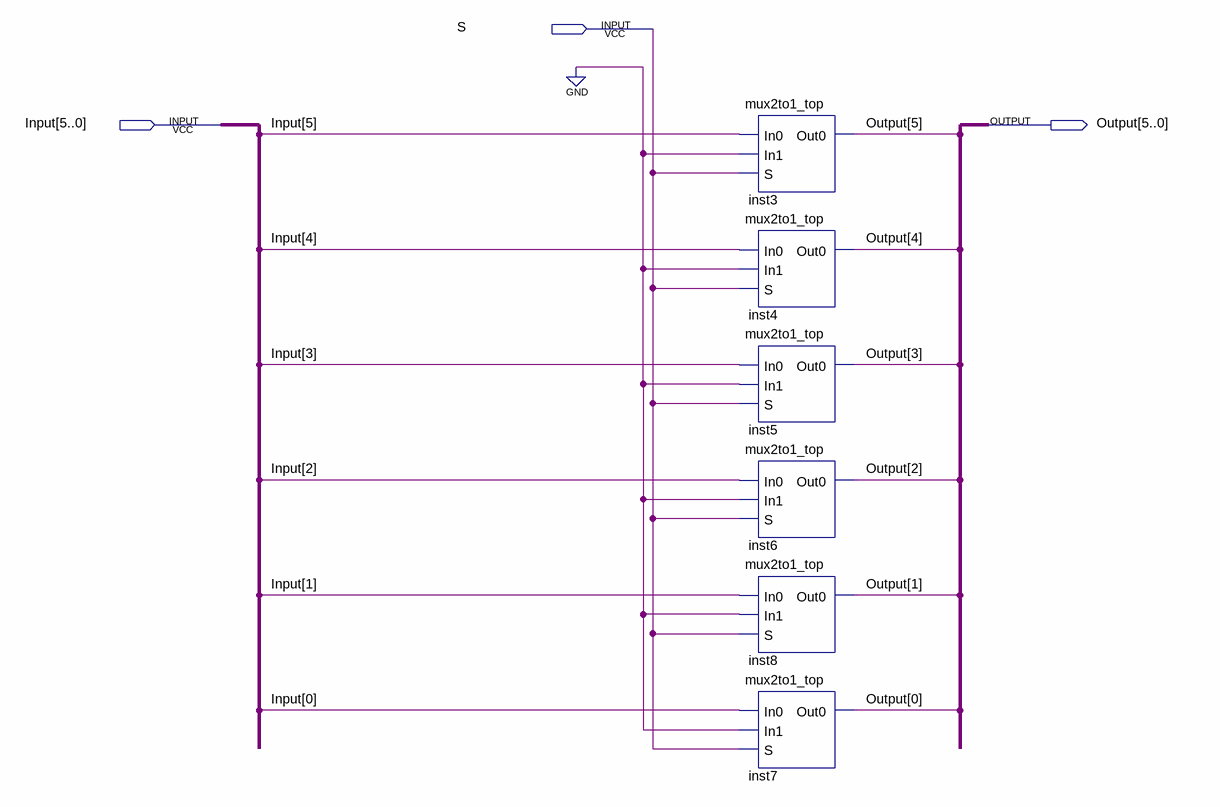
[diagram p0: schematic sheet]
// Quartus schematic mux_data_or_zero.bdf as structural Verilog: 6 symbols, 3 pins
module mux_data_or_zero (
  input  S,
  input  [5:0] Input,
  output [5:0] Output
);

  mux2to1_top inst3 (.In0(Input[5]), .In1(1'b0), .S(S), .Out0(Output[5]));
  mux2to1_top inst4 (.In0(Input[4]), .In1(1'b0), .S(S), .Out0(Output[4]));
  mux2to1_top inst5 (.In0(Input[3]), .In1(1'b0), .S(S), .Out0(Output[3]));
  mux2to1_top inst6 (.In0(Input[2]), .In1(1'b0), .S(S), .Out0(Output[2]));
  mux2to1_top inst8 (.In0(Input[1]), .In1(1'b0), .S(S), .Out0(Output[1]));
  mux2to1_top inst7 (.In0(Input[0]), .In1(1'b0), .S(S), .Out0(Output[0]));
endmodule
